# Altium project HW_RV_TOUCH_R1M1.PrjPcb (part 2 of 4)

## Sheet 06_BUTTONS.SchDoc: =TitleParameter
size A3; Address: Crete IL; Organization: ASISGUARD; Address1: Kemalpasa, Kemalpasa Cd. No:290 D:292H, 35060 Bornova/Izmir/Turkey; Revision: R1M1
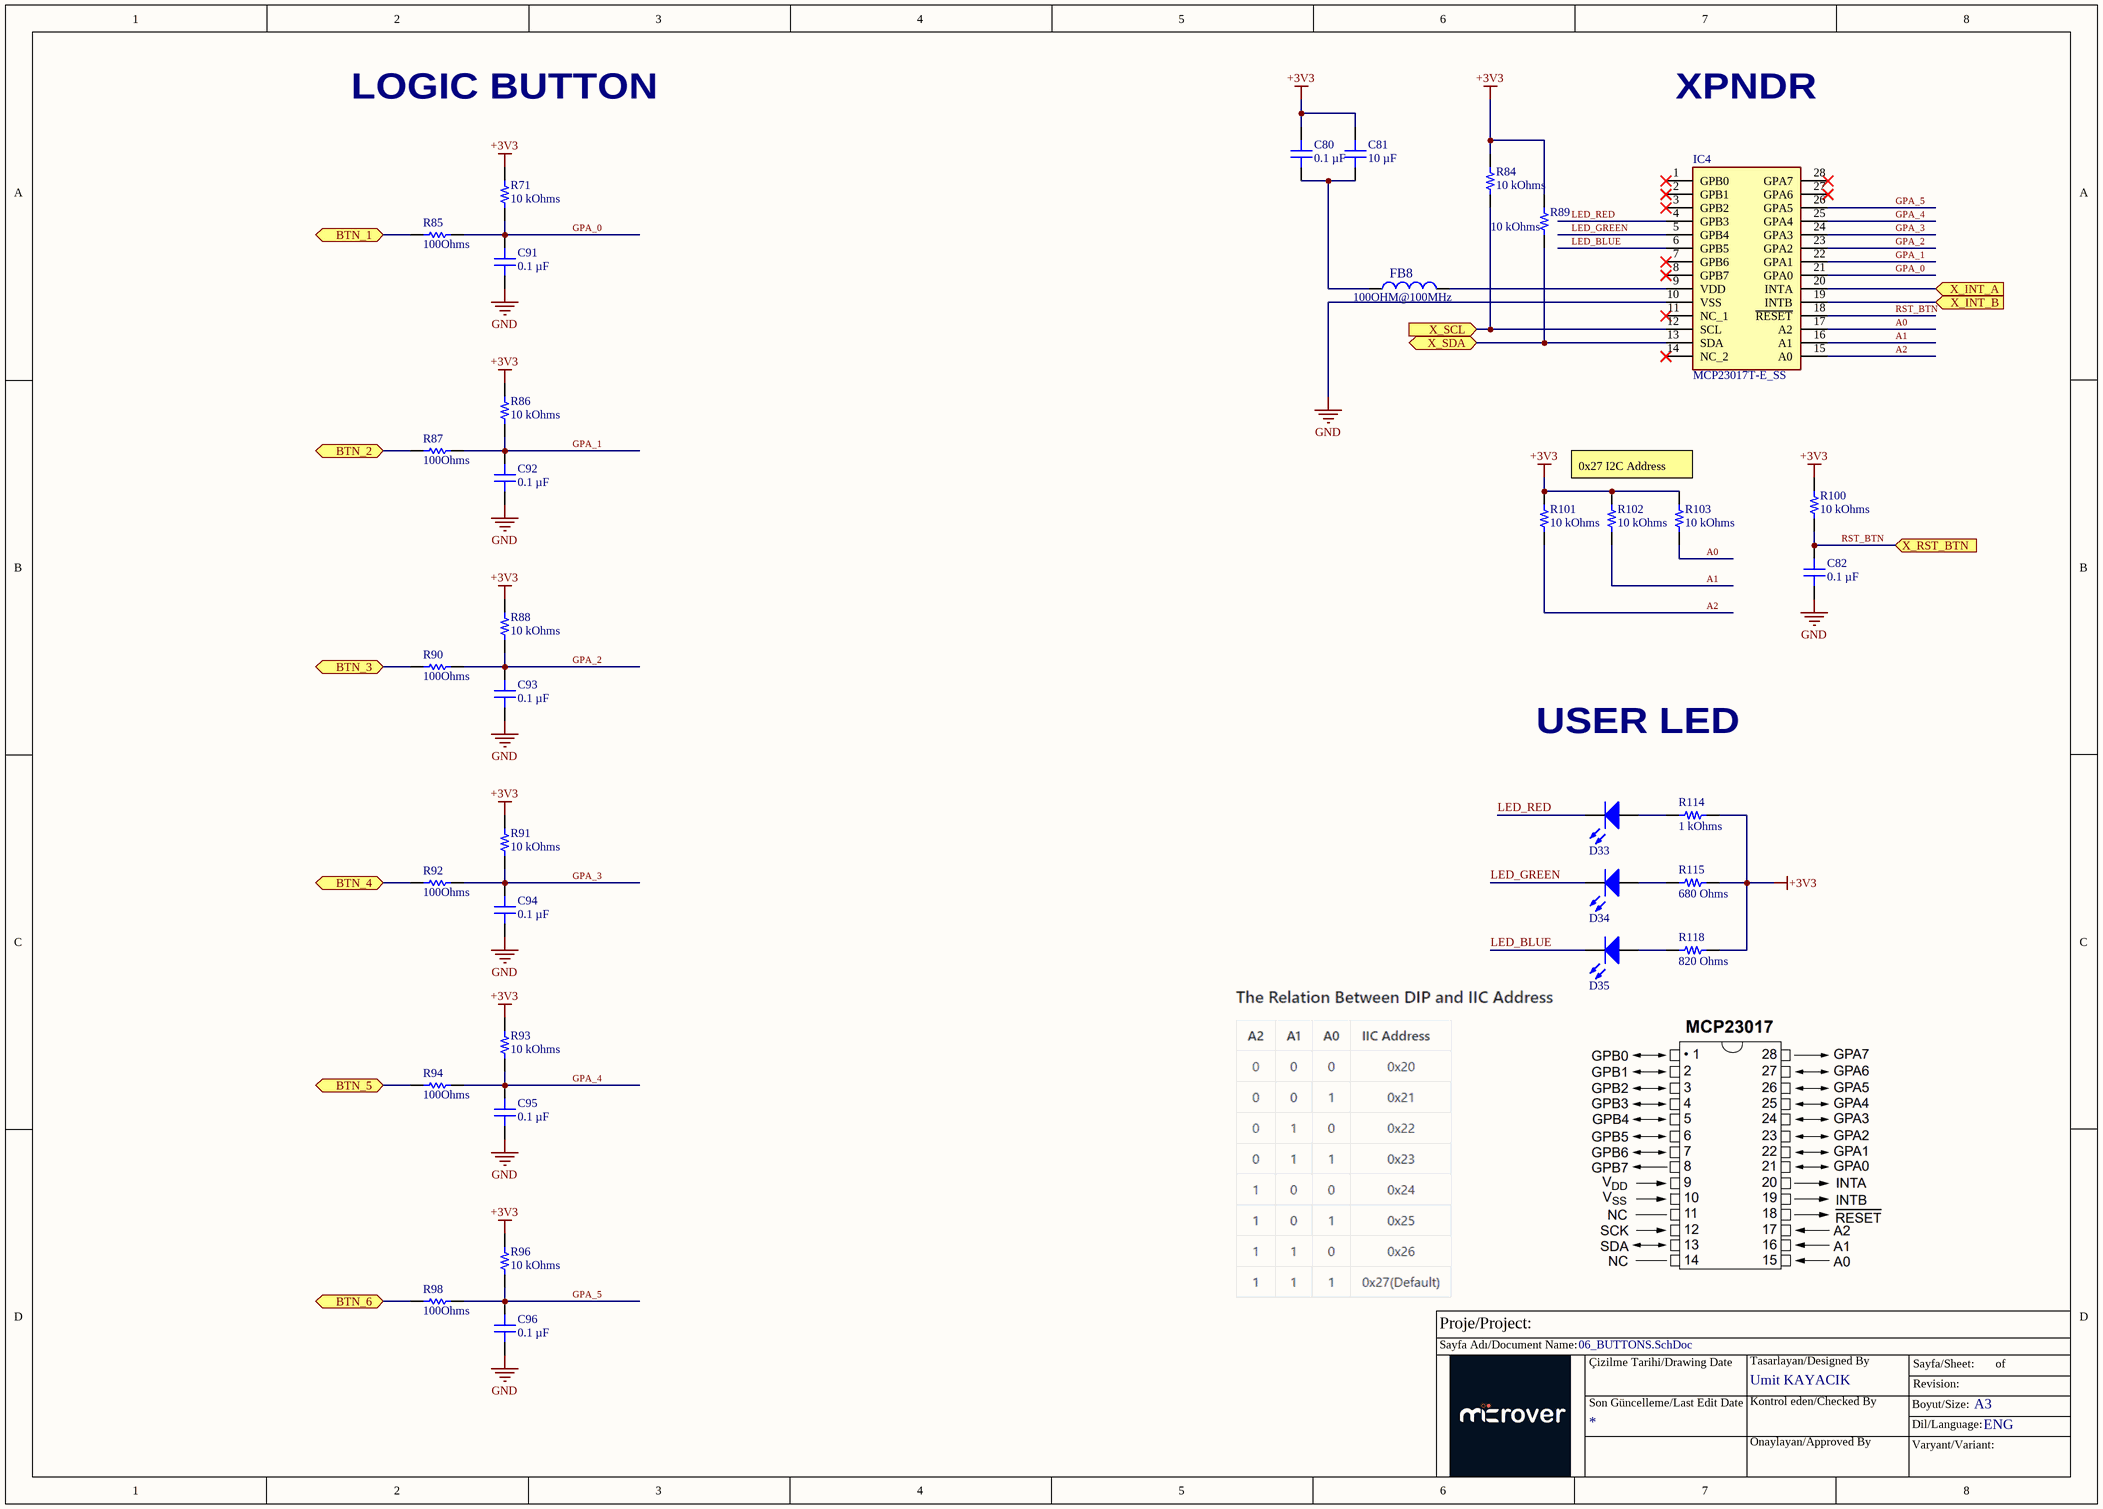
[diagram p5: 06_BUTTONS.SchDoc]

### Parts
C80  0.1 µF  [CAP 0603_1608]
C81  10 µF  [CAP 0603_1608]
C82  0.1 µF  [CAP 0603_1608]
C91  0.1 µF  [CAP0603]
C92  0.1 µF  [CAP0603]
C93  0.1 µF  [CAP0603]
C94  0.1 µF  [CAP0603]
C95  0.1 µF  [CAP0603]
C96  0.1 µF  [CAP0603]
D33  LED RED  [LED0805]  (value not drawn)
D34  LED GREEN  [LED0805]  (value not drawn)
D35  LED BLUE  [LED0805]  (value not drawn)
FB8  100OHM@100MHz  [FB 0603(1608)]
IC4  MCP23017T-E_SS  [SOP65P780X200-28N]
R71  10 kOhms  [RES0402(1005)]
R84  10 kOhms  [RES 0402_1005]
R85  100Ohms  [RESC1005X40X25ML05T10]
R86  10 kOhms  [RES0402(1005)]
R87  100Ohms  [RESC1005X40X25ML05T10]
R88  10 kOhms  [RES0402(1005)]
R89  10 kOhms  [RES 0402_1005]
R90  100Ohms  [RESC1005X40X25ML05T10]
R91  10 kOhms  [RES0402(1005)]
R92  100Ohms  [RESC1005X40X25ML05T10]
R93  10 kOhms  [RES0402(1005)]
R94  100Ohms  [RESC1005X40X25ML05T10]
R96  10 kOhms  [RES0402(1005)]
R98  100Ohms  [RESC1005X40X25ML05T10]
R100  10 kOhms  [RES 0402_1005]
R101  10 kOhms  [RES 0402_1005]
R102  10 kOhms  [RES 0402_1005]
R103  10 kOhms  [RES 0402_1005]
R114  1 kOhms  [RES 0402_1005]
R115  680 Ohms  [RES 0402_1005]
R118  820 Ohms  [RES 0402_1005]

### Ports
BTN_1 (bidir), BTN_2 (bidir), BTN_3 (bidir), BTN_4 (bidir), BTN_5 (bidir), BTN_6 (bidir), X_INT_A (in), X_INT_B (in), X_RST_BTN (in), X_SCL (in), X_SDA (bidir)

### Nets
+3V3: C80.2 C81.2 R71.2 R84.2 R86.2 R88.2 R89.2 R91.2 R93.2 R96.2 R100.2 R101.2 R102.2 R103.2 R114.2 R115.2 R118.2
GND: C82.1 C91.1 C92.1 C93.1 C94.1 C95.1 C96.1 IC4.10(VSS)
A0: IC4.17(A2) R103.1
A1: IC4.16(A1) R102.1
A2: IC4.15(A0) R101.1
GPA_0: C91.2 IC4.21(GPA0) R71.1 R85.2
GPA_1: C92.2 IC4.22(GPA1) R86.1 R87.2
GPA_2: C93.2 IC4.23(GPA2) R88.1 R90.2
GPA_3: C94.2 IC4.24(GPA3) R91.1 R92.2
GPA_4: C95.2 IC4.25(GPA4) R93.1 R94.2
GPA_5: C96.2 IC4.26(GPA5) R96.1 R98.2
LED_BLUE: D35.1(K) IC4.6(GPB5)
LED_GREEN: D34.1(K) IC4.5(GPB4)
LED_RED: D33.1(K) IC4.4(GPB3)
RST_BTN: C82.2 IC4.18(~{RESET}) R100.1 ; port X_RST_BTN
NetC80_1: C80.1 C81.1 FB8.2
NetD33_2: D33.2(A) R114.1
NetD34_2: D34.2(A) R115.1
NetD35_2: D35.2(A) R118.1
NetFB8_1: FB8.1 IC4.9(VDD)
NetIC4_12: IC4.12(SCL) R84.1 ; port X_SCL
NetIC4_13: IC4.13(SDA) R89.1 ; port X_SDA
NetIC4_19: IC4.19(INTB) ; port X_INT_B
NetIC4_20: IC4.20(INTA) ; port X_INT_A
NetJ12_1: R98.1 ; port BTN_6
NetJ12_2: R94.1 ; port BTN_5
NetJ12_3: R92.1 ; port BTN_4
NetJ12_4: R90.1 ; port BTN_3
NetJ12_5: R87.1 ; port BTN_2
NetJ12_6: R85.1 ; port BTN_1

Not connected (* = marked no-connect by the designer): IC4 1(GPB0)* 2(GPB1)* 3(GPB2)* 7(GPB6)* 8(GPB7)* 11(NC_1)* 14(NC_2)* 27(GPA6)* 28(GPA7)*

### Notes on the sheet
- LOGIC BUTTON
- XPNDR
- 0x27 I2C Address
- USER LED
- Proje/Project:
- Sayfa Adı/Document Name:
- Çizilme Tarihi/Drawing Date
- Umit KAYACIK
- Tasarlayan/Designed By
- Sayfa/Sheet:
- Revision:
- of
- Son Güncelleme/Last Edit Date
- Kontrol eden/Checked By
- Onaylayan/Approved By
- Boyut/Size:
- Varyant/Variant:
- Dil/Language:
- A3
- ENG

### Library data of the parts
C80 C82 C91-C96 = VJ0603Y104KXAPW1BC: CAP CER 0.1UF 50V X7R 0603; manufacturer: Vishay Vitramon; Tolerance: ±10%; Part Number: VJ0603Y104KXAPW1BC; Value: 0.1 µF; Applications: General Purpose; Capacitance: 0.1 µF; componentlink2description: DigiKey Link; componentlink2url: https://www.digikey.com/en/products/detail/vishay-vitramon/VJ0603Y104KXAPW1BC/10670836; Device Package: 0603 (1608 Metric); lastupdated: 2/9/2024 8:09:50 PM; Lifecycle Status: Active; Minimum Order: 1; Mounting Type: Surface Mount, MLCC; Operating Temperature: -55°C ~ 125°C; Package / Case: 0603 (1608 Metric); packaging: TapeAndReel; partid: 45127; Part Status: Active; price: 0.02; series: VJ W1BC; Size / Dimension: 0.063" L x 0.031" W (1.60mm x 0.80mm); Supplier 1: DigiKey; Supplier Part Number 1: 720-VJ0603Y104KXAPW1BCCT-ND; Temperature Coefficient: X7R; Thickness (Max): 0.037" (0.95mm); Voltage - Rated: 50V
C81 = KGM15CR51C106KT: CAP CER 10UF 16V X5R 0603; manufacturer: KYOCERA AVX; Tolerance: ±10%; Part Number: KGM15CR51C106KT; Value: 10 µF; Applications: General Purpose; Capacitance: 10 µF; componentlink1description: Datasheet; componentlink1url: https://datasheets.kyocera-avx.com/cx5r.pdf; componentlink2description: DigiKey Link; componentlink2url: https://www.digikey.com/en/products/detail/kyocera-avx/KGM15CR51C106KT/17866320; Device Package: 0603 (1608 Metric); lastupdated: 2/9/2024 8:08:56 PM; Lifecycle Status: Active; Minimum Order: 1; Mounting Type: Surface Mount, MLCC; Operating Temperature: -55°C ~ 85°C; Package / Case: 0603 (1608 Metric); packaging: TapeAndReel; partid: 54717; Part Status: Active; price: 0.03; series: KGM - X5R; Size / Dimension: 0.063" L x 0.031" W (1.60mm x 0.80mm); Supplier 1: DigiKey; Supplier Part Number 1: 478-KGM15CR51C106KTCT-ND; Temperature Coefficient: X5R; Thickness (Max): 0.039" (1.00mm); Voltage - Rated: 16V
D33 = LED0805_RED: SMD mono-color Chip LED, WL-SMCW, Red; Manufacturer Part Number: 150080RS75000; Manufacturer: Wuerth Elektronik; ComponentLink1Description: Manufacturer URL; ComponentLink2Description: Datasheet; Color: Red; ComponentLink1URL: http://www.we-online.com; PackageReference: 0805_A; ComponentLink2URL: http://katalog.we-online.com/led/datasheet/150080RS75000.pdf
D34 = LED0805_GREEN: Green 570nm LED Indication - Discrete 2.1V 0805 (2012 Metric); Manufacturer Part Number: CMD17-21VGC/TR8; Manufacturer: Visual Communications Company - VCC; Color: Red; ComponentLink1Description: Manufacturer URL; ComponentLink2Description: Datasheet; ComponentLink1URL: http://www.we-online.com; PackageReference: 0805_A; ComponentLink2URL: http://katalog.we-online.com/led/datasheet/150080RS75000.pdf
D35 = LED0805_BLUE: Blue 470nm LED Indication - Discrete 3V 0805 (2012 Metric); Manufacturer Part Number: IN-S85AT5B; Manufacturer: Inolux; Color: Red; ComponentLink1Description: Manufacturer URL; ComponentLink2Description: Datasheet; ComponentLink1URL: http://www.we-online.com; PackageReference: 0805_A; ComponentLink2URL: http://katalog.we-online.com/led/datasheet/150080RS75000.pdf
FB8 = FB0603_100OHM_100MHz: 100 Ohms @ 100 MHz 1 Power Line Ferrite Bead 0603 (1608 Metric) 2A 40mOhm; Manufacturer: TDK; Manufacturer Part Number: MPZ1608Y101BTA00; Tolerance: 25%; Impedance: 100R; DC Resistance (DCR): 40mR; ComponentLink1URL: https://chn-vm-apps.microchip.com/mchprepo/parts/Datasheets/beads_commercial_power_mpz_en.pdf; ComponentLink1Description: Datasheet; Supplier 1: Digi-Key; Supplier Part Number 1: 445-2984-1-ND; RoHS: Yes; Category: Ferrite Beads and Chips; Stock 1: 551; Pricing 1: 1=0,10000, 10=0,07200, 25=0,06480, 50=0,05840, 100=0,04290, 250=0,03120, 500=0,02860, 1000=0,02470 (USD); Mount: Surface Mount; Case/Package: 0603; Case Code (Metric): 1608; Case Code (Imperial): 0603; Core Material: Ferrite; Packaging: Tape and Reel; Package Quantity: 4000; Max DC Current: 2A; Current Rating: 2A; Series: MPZ; Length: 0.063inch; Width: 0.031inch; Height: 0.037inch; RoHS Compliant: Yes; REACH SVHC: No SVHC; ComponentLink2URL: https://datasheet.ciiva.com/46634/beads-commercial-power-mpz-en-46634677.pdf?src-supplier=Digi-Key; ComponentLink2Description: https://datasheet.ciiva.com/46634/beads-commercial-power-mpz-en-46634677.pdf?src-supplier=Digi-Key; ComponentLink3URL: https://datasheet.ciiva.com/48682/beads-commercial-power-mpz-en-48682501.pdf?src-supplier=Avnet; ComponentLink3Description: https://datasheet.ciiva.com/48682/beads-commercial-power-mpz-en-48682501.pdf?src-supplier=Avnet; ComponentLink4URL: https://datasheet.ciiva.com/46634/beads-commercial-power-mpz-en-46634684.pdf?src-supplier=Digi-Key; ComponentLink4Description: https://datasheet.ciiva.com/46634/beads-commercial-power-mpz-en-46634684.pdf?src-supplier=Digi-Key; ComponentLink5URL: https://datasheet.ciiva.com/46634/beads-commercial-power-mpz-en-46634621.pdf?src-supplier=Digi-Key; ComponentLink5Description: https://datasheet.ciiva.com/46634/beads-commercial-power-mpz-en-46634621.pdf?src-supplier=Digi-Key; Parameter 1: *; LCSC Manufacturer Part Number: MPZ1608Y101BTA00; LCSC Part Number: C501996
IC4 = MCP23017T-E_SS: Integrated Circuit; Manufacturer_Name: Microchip; Manufacturer_Part_Number: MCP23017T-E/SS; Datasheet Link: https://datasheet.datasheetarchive.com/originals/distributors/SFDatasheet-4/sf-00090057.pdf; Height: 2mm; Mouser Part Number: 579-MCP23017T-E/SS; Mouser Price/Stock: https://www.mouser.co.uk/ProductDetail/Microchip-Technology/MCP23017T-E-SS?qs=usxtMOJb1Rz2FhASIaFluQ%3D%3D; Arrow Part Number: MCP23017T-E/SS; Arrow Price/Stock: https://www.arrow.com/en/products/mcp23017t-ess/microchip-technology?region=nac
R71 R84 R86 R88 R89 R91 R93 R96 R100-R103 = RP73PF1E10KBTD: RES 10K OHM 0.1% 1/10W 0402; Manufacturer: TE Connectivity Passive Product; Power (Watts): 0.1W, 1/10W; Temperature Coefficient: ±25ppm/°C; Part Number: RP73PF1E10KBTD; Value: 10 kOhms; ComponentLink1Description: Datasheet; ComponentLink1URL: https://www.te.com/commerce/DocumentDelivery/DDEController?Action=srchrtrv&DocNm=1773272&DocType=DS&DocLang=English; ComponentLink2Description: DigiKey Link; ComponentLink2URL: https://www.digikey.com/en/products/detail/te-connectivity-passive-product/RP73PF1E10KBTD/8260957; Composition: Thin Film; Device Package: 0402 (1005 Metric); Height - Seated (Max): 0.014" (0.35mm); LastUpdated: 2/9/2024 8:30:24 PM; Lifecycle Status: Active; Minimum Order: 1; Number of Terminations: 2; Operating Temperature: -55°C ~ 155°C; Package / Case: 0402 (1005 Metric); Packaging: TapeAndReel; PartId: 2434; Part Status: Active; Price: 0.08; Resistance: 10 kOhms; Series: RP73, Holsworthy; Size / Dimension: 0.039" L x 0.020" W (1.00mm x 0.50mm); Supplier 1: DigiKey; Supplier Part Number 1: A127415CT-ND; Supplier Device Package: 0402; Tolerance: ±0.1%
R85 R87 R90 R92 R94 R98 = CMP-2002-07344-1: Part Number: RC0402FR-07100RL; Manufacturer: Yageo / Phycomp
R114 = ERJ-U02D1001X: 0402 ANTI-SULFUR RES. , 0.5%, 1K; Manufacturer: Panasonic Electronic Components; Power (Watts): 0.1W, 1/10W; Temperature Coefficient: ±200ppm/°C; Part Number: ERJ-U02D1001X; Value: 1 kOhms; ComponentLink1Description: Datasheet; ComponentLink1URL: https://industrial.panasonic.com/cdbs/www-data/pdf/RDP0000/AOA0000C334.pdf; ComponentLink2Description: DigiKey Link; ComponentLink2URL: https://www.digikey.com/en/products/detail/panasonic-electronic-components/ERJ-U02D1001X/9365326; Composition: Thick Film; Device Package: 0402 (1005 Metric); Features: Anti-Sulfur, Automotive AEC-Q200; Height - Seated (Max): 0.016" (0.40mm); LastUpdated: 2/9/2024 8:28:26 PM; Lifecycle Status: Active; Minimum Order: 1; Number of Terminations: 2; Operating Temperature: -55°C ~ 155°C; Package / Case: 0402 (1005 Metric); Packaging: TapeAndReel; PartId: 81776; Price: 0.01; Ratings: AEC-Q200; Resistance: 1 kOhms; Series: ERJ-U02; Size / Dimension: 0.039" L x 0.020" W (1.00mm x 0.50mm); Supplier 1: DigiKey; Supplier Part Number 1: 10-ERJ-U02D1001XCT-ND; Supplier Device Package: 0402; Tolerance: ±0.5%
R115 = ERJ-U02F6800X: RES 680 OHM 1% 1/10W 0402 SMD; Manufacturer: Panasonic Electronic Components; Power (Watts): 0.1W, 1/10W; Temperature Coefficient: ±200ppm/°C; Part Number: ERJ-U02F6800X; Value: 680 Ohms; ComponentLink1Description: Datasheet; ComponentLink1URL: https://industrial.panasonic.com/cdbs/www-data/pdf/RDP0000/AOA0000C334.pdf; ComponentLink2Description: DigiKey Link; ComponentLink2URL: https://www.digikey.com/en/products/detail/panasonic-electronic-components/ERJ-U02F6800X/11635400; Composition: Thick Film; Device Package: 0402 (1005 Metric); Features: Anti-Sulfur, Automotive AEC-Q200; Height - Seated (Max): 0.016" (0.40mm); LastUpdated: 2/9/2024 8:29:06 PM; Lifecycle Status: Active; Minimum Order: 1; Number of Terminations: 2; Operating Temperature: -55°C ~ 155°C; Package / Case: 0402 (1005 Metric); Packaging: TapeAndReel; PartId: 60041; Part Status: Active; Price: 0.01; Ratings: AEC-Q200; Resistance: 680 Ohms; Series: ERJ-U02; Size / Dimension: 0.039" L x 0.020" W (1.00mm x 0.50mm); Supplier 1: DigiKey; Supplier Part Number 1: 10-ERJ-U02F6800XCT-ND; Supplier Device Package: 0402; Tolerance: ±1%
R118 = ERJ-2RKF8200X: RES SMD 820 OHM 1% 1/10W 0402; Manufacturer: Panasonic Electronic Components; Power (Watts): 0.1W, 1/10W; Temperature Coefficient: ±100ppm/°C; Part Number: ERJ-2RKF8200X; Value: 820 Ohms; ComponentLink1Description: Datasheet; ComponentLink1URL: https://industrial.panasonic.com/cdbs/www-data/pdf/RDA0000/AOA0000C304.pdf; ComponentLink2Description: DigiKey Link; ComponentLink2URL: https://www.digikey.com/en/products/detail/panasonic-electronic-components/ERJ-2RKF8200X/1746279; Composition: Thick Film; Device Package: 0402 (1005 Metric); Features: Automotive AEC-Q200; Height - Seated (Max): 0.016" (0.40mm); LastUpdated: 2/9/2024 8:29:33 PM; Lifecycle Status: Active; Minimum Order: 1; Number of Terminations: 2; Operating Temperature: -55°C ~ 155°C; Package / Case: 0402 (1005 Metric); Packaging: CutTape; PartId: 18007; Part Status: Active; Price: 0.01; Ratings: AEC-Q200; Resistance: 820 Ohms; Series: ERJ-2RK; Size / Dimension: 0.039" L x 0.020" W (1.00mm x 0.50mm); Supplier 1: DigiKey; Supplier Part Number 1: P820LCT-ND; Supplier Device Package: 0402; Tolerance: ±1%

## Sheet 07_GSM_EM05.SchDoc: =TitleParameter
size A3; Address: Crete IL; Organization: ASISGUARD; Address1: Kemalpasa, Kemalpasa Cd. No:290 D:292H, 35060 Bornova/Izmir/Turkey; Revision: R1M1
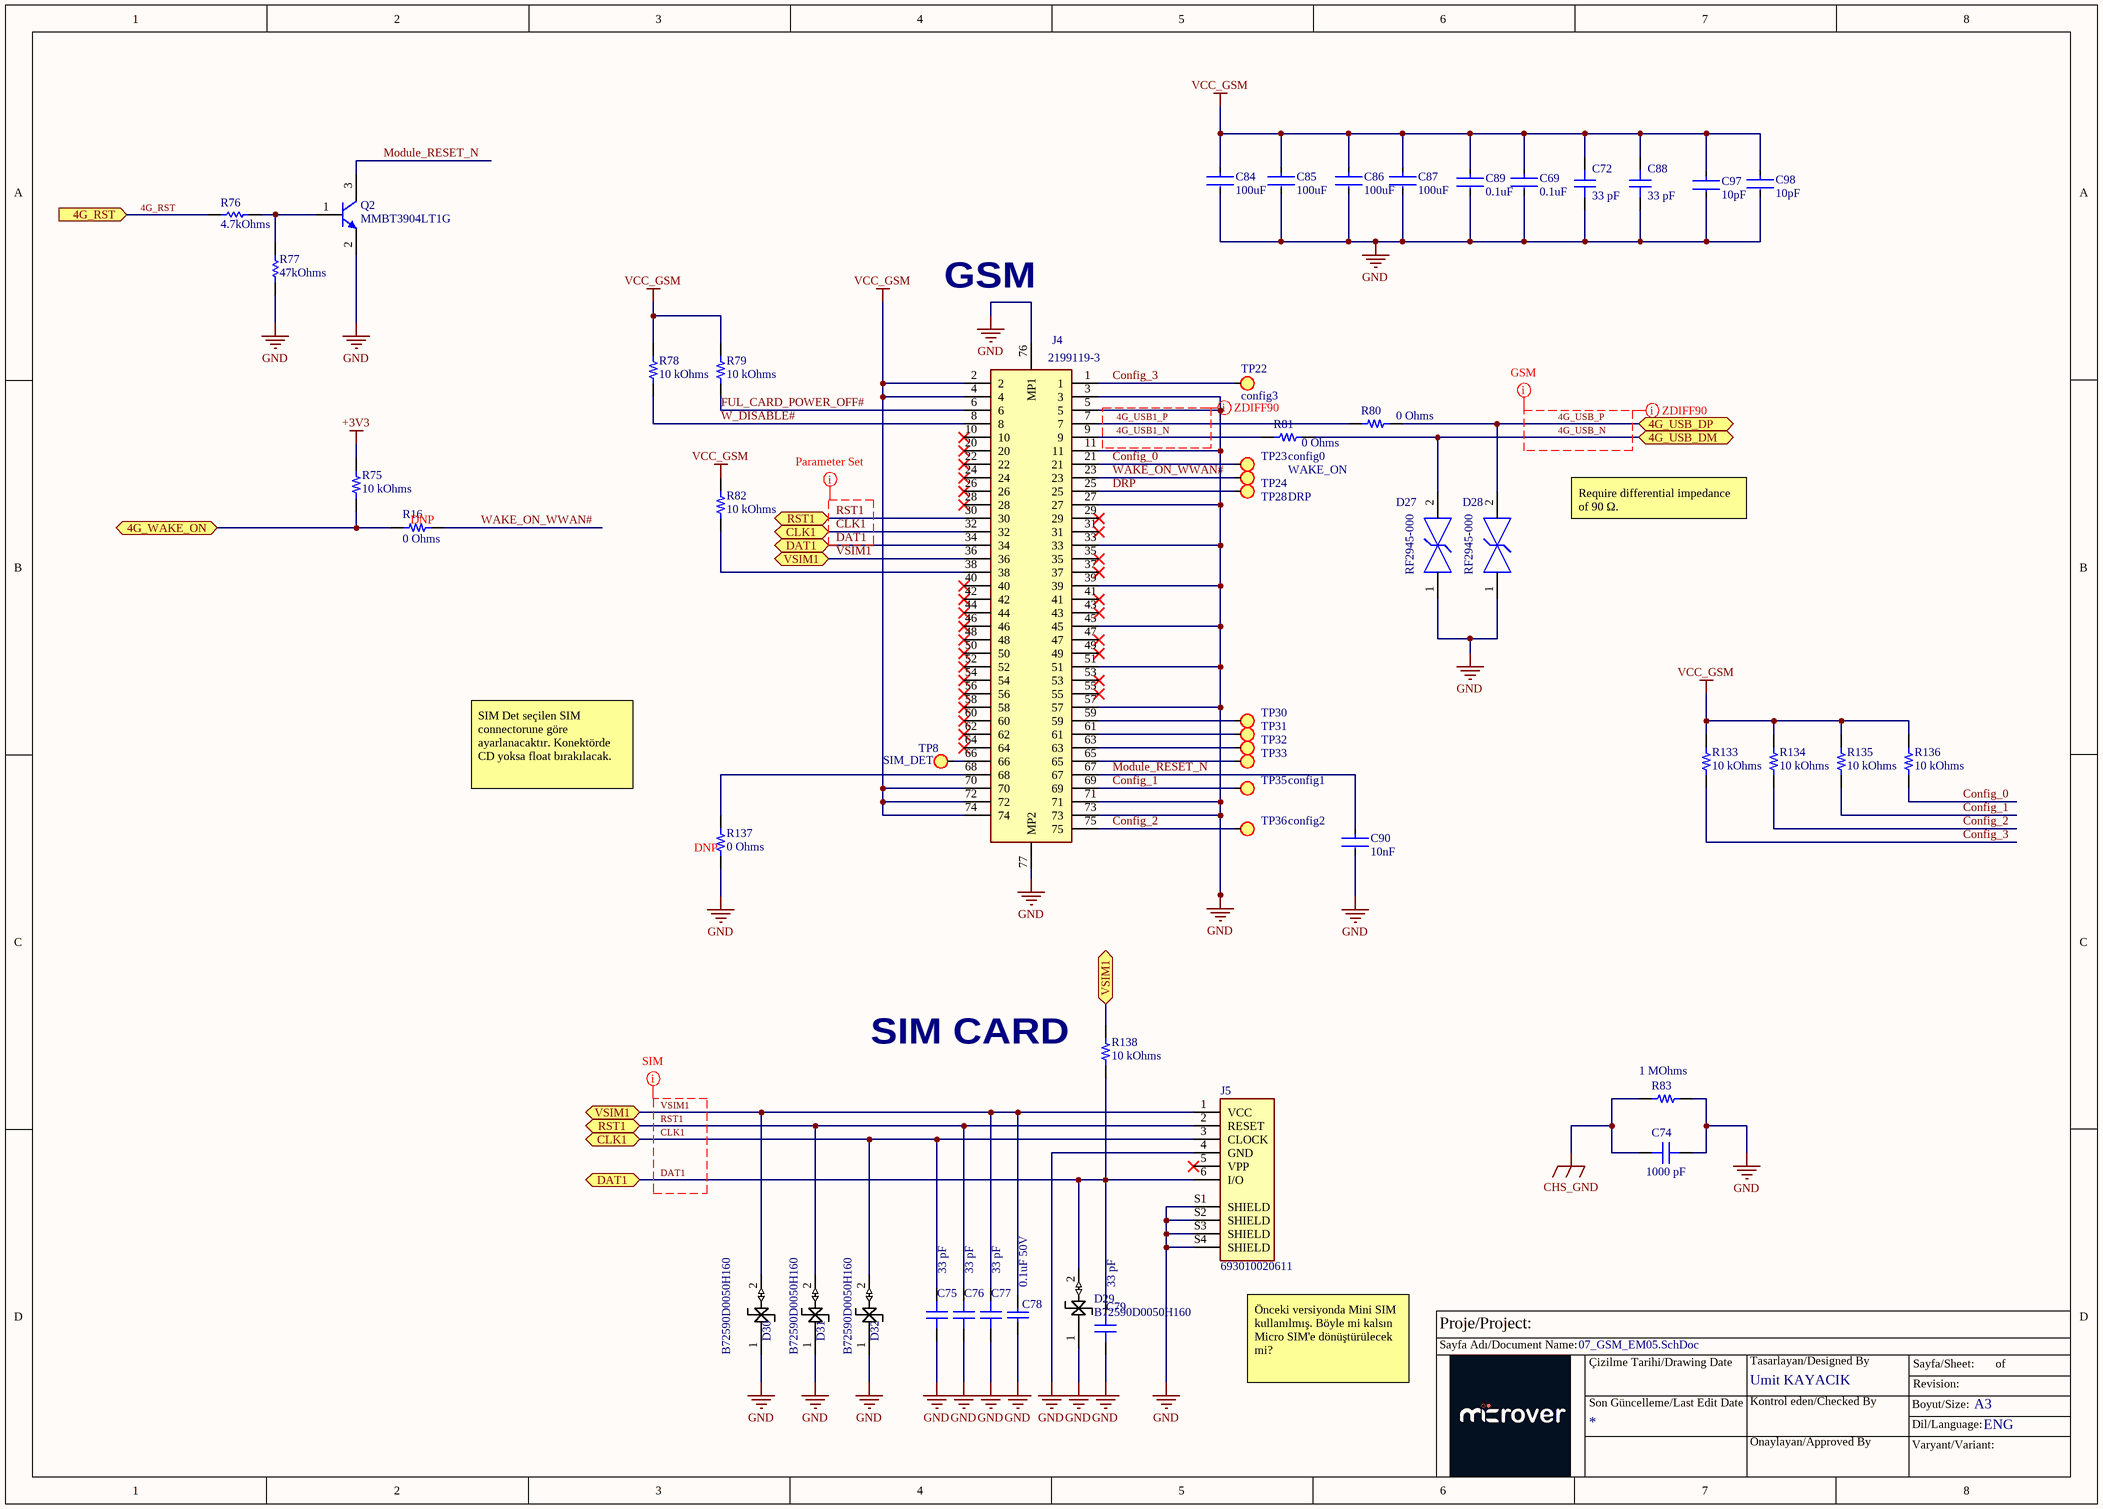
[diagram p6: 07_GSM_EM05.SchDoc]

### Parts
C69  0.1uF  [FP-GRM15-MFG]
C72  33 pF  [CAP0402(1005)X0.5]
C74  1000 pF  [CAP 1206_3216 - 0.8MM]
C75  33 pF  [CAP 0402_1005]
C76  33 pF  [CAP 0402_1005]
C77  33 pF  [CAP 0402_1005]
C78  value 0.1uF 50V  [SMC0603]  (hidden comment: CAP CER 0.1UF 50V X7R 0603)
C79  33 pF  [CAP 0402_1005]
C84  100uF  [FP-C3216-160-0_3-IPC_C]
C85  100uF  [FP-C3216-160-0_3-IPC_C]
C86  100uF  [FP-C3216-160-0_3-IPC_C]
C87  100uF  [FP-C3216-160-0_3-IPC_C]
C88  33 pF  [CAP0402(1005)X0.5]
C89  0.1uF  [FP-GRM15-MFG]
C90  10nF  [FP-CL165-IPC_C]
C97  10pF  [FP-CGA2B-MFG]
C98  10pF  [FP-CGA2B-MFG]
D27  RF2945-000  [FP-SESD0402-MFG]
D28  RF2945-000  [FP-SESD0402-MFG]
D29  B72590D0050H160  [SOD1005X60N]
D30  B72590D0050H160  [SOD1005X60N]
D31  B72590D0050H160  [SOD1005X60N]
D32  B72590D0050H160  [SOD1005X60N]
J4  2199119-3  [2199119-3]
J5  693010020611  [WURTH_693010020611]
Q2  MMBT3904LT1G  [ONSC-SOT-23-3-318-08_V]
R16  0 Ohms  [RES0402(1005)]
R75  10 kOhms  [RES 0402_1005]
R76  4.7kOhms  [RESC1005X40X25NL05T10]
R77  47kOhms  [RESC1005X40X25ML05T10]
R78  10 kOhms  [RES 0402_1005]
R79  10 kOhms  [RES 0402_1005]
R80  0 Ohms  [RES 0402_1005]
R81  0 Ohms  [RES 0402_1005]
R82  10 kOhms  [RES 0402_1005]
R83  1 MOhms  [RES 0402_1005]
R133  10 kOhms  [RES0402(1005)]
R134  10 kOhms  [RES0402(1005)]
R135  10 kOhms  [RES0402(1005)]
R136  10 kOhms  [RES0402(1005)]
R137  0 Ohms  [RES0402(1005)]
R138  10 kOhms  [RES0402(1005)]
TP8  SIM_DET  [TEST_POINT]
TP22  config3  [TEST_POINT]
TP23  config0  [TEST_POINT]
TP24  WAKE_ON  [TEST_POINT]
TP28  DRP  [TEST_POINT]
TP30  (no value)  [TEST_POINT]
TP31  config0  [TEST_POINT]  (value not drawn)
TP32  (no value)  [TEST_POINT]
TP33  (no value)  [TEST_POINT]
TP35  config1  [TEST_POINT]
TP36  config2  [TEST_POINT]

### Ports
4G_RST (in), 4G_USB_DM (bidir), 4G_USB_DP (bidir), 4G_WAKE_ON (bidir), CLK1 (bidir), DAT1 (bidir), RST1 (bidir), VSIM1 (bidir)

### Nets
+3V3: R75.2
CHS_GND: C74.1 R83.1
GND: C69.1 C72.1 C74.2 C75.1 C76.1 C77.1 C78.1 C79.1 C84.2 C85.2 C86.2 C87.2 C88.1 C89.1 C90.2 C97.2 C98.2 D27.1 D28.1 D29.1(GND) D30.1(GND) D31.1(GND) D32.1(GND) J4.3 J4.5 J4.11 J4.27 J4.33 J4.39 J4.45 J4.51 J4.57 J4.71 J4.73 J4.76(MP1) J4.77(MP2) J5.4(GND) J5.S1(SHIELD) J5.S2(SHIELD) J5.S3(SHIELD) J5.S4(SHIELD) Q2.2(E) R77.1 R83.2 R137.2
VCC_GSM: C69.2 C72.2 C84.1 C85.1 C86.1 C87.1 C88.2 C89.2 C97.1 C98.1 J4.2 J4.4 J4.70 J4.72 J4.74 R78.2 R79.2 R82.2 R133.2 R134.2 R135.2 R136.2
4G_RST: R76.1 ; port 4G_RST
4G_USB1_N: J4.9 R81.2
4G_USB1_P: J4.7 R80.2
4G_USB_N: D27.2 R81.1 ; port 4G_USB_DM
4G_USB_P: D28.2 R80.1 ; port 4G_USB_DP
CLK1: C75.2 D32.2(I/OLINE) J4.32 J5.3(CLOCK) ; port CLK1
Config_0: J4.21 R136.1 TP23.1(TP)
Config_1: J4.69 R135.1 TP35.1(TP)
Config_2: J4.75 R134.1 TP36.1(TP)
Config_3: J4.1 R133.1 TP22.1(TP)
DAT1: C79.2 D29.2(I/OLINE) J4.34 J5.6(I/O) R138.1 ; port DAT1
DRP: J4.25 TP28.1(TP)
FUL_CARD_POWER_OFF#: J4.6 R79.1
Module_RESET_N: C90.1 J4.67 Q2.3(C)
RST1: C76.2 D31.2(I/OLINE) J4.30 J5.2(RESET) ; port RST1
VSIM1: C77.2 C78.2 D30.2(I/OLINE) J4.36 J5.1(VCC) R138.2 ; port VSIM1
W_DISABLE#: J4.8 R78.1
WAKE_ON_WWAN#: J4.23 R16.2 TP24.1(TP)
NetJ4_38: J4.38 R82.1
NetJ4_59: J4.59 TP30.1(TP)
NetJ4_61: J4.61 TP31.1(TP)
NetJ4_63: J4.63 TP32.1(TP)
NetJ4_65: J4.65 TP33.1(TP)
NetJ4_66: J4.66 TP8.1(TP)
NetJ4_68: J4.68 R137.1
NetQ2_1: Q2.1(B) R76.2 R77.2
NetR16_1: R16.1 R75.1 ; port 4G_WAKE_ON

Not connected (* = marked no-connect by the designer): J4 10* 20* 22* 24* 26* 28* 29* 31* 35* 37* 40* 41* 42* 43* 44* 46* 47* 48* 49* 50* 52* 53* 54* 55* 56* 58* 60* 62* 64*; J5 5(VPP)*

### Layout directives
net class SIM: CLK1, DAT1, RST1, VSIM1
differential pair; differential pair class ZDIFF90: 4G_USB1_N, 4G_USB1_P, 4G_USB_N, 4G_USB_P
net class GSM: 4G_USB_N, 4G_USB_P
net class SIM; rule Matched Net Lengths [Tolerance = 20mil]: CLK1, DAT1, RST1

### Notes on the sheet
- GSM
- Require differential impedance of 90 Ω.
- (near R16) DNP
- SIM Det seçilen SIM connectorune göre ayarlanacaktır. Konektörde CD yoksa float bırakılacak.
- (near R137) DNP
- SIM CARD
- Önceki versiyonda Mini SIM kullanılmış. Böyle mi kalsın Micro SIM'e dönüştürülecek mi?
- Proje/Project:
- Sayfa Adı/Document Name:
- Çizilme Tarihi/Drawing Date
- Umit KAYACIK
- Tasarlayan/Designed By
- Sayfa/Sheet:
- Revision:
- of
- Son Güncelleme/Last Edit Date
- Kontrol eden/Checked By
- Onaylayan/Approved By
- Boyut/Size:
- Varyant/Variant:
- Dil/Language:
- A3
- ENG

### Library data of the parts
C69 C89 = CMP-2100-03641-2: CAP CER 0.1UF 16V X7R 0402; Part Number: GRM155R71C104KA88D; Manufacturer: Murata; Standoff Height: 0mm; Tolerance: 10%; Voltage Rating: 16Vdc; Material: Ceramic; Capacitance: 0.10μF; Value: 0.10μF; RoHS: TRUE; Temperature Characteristic: X7R; Octopart: https://octopart.com/grm155r71c104ka88d-murata-196880; Digikey Description: CAP CER 0.1UF 16V X7R 0402; Device Class L3: Ceramic Capacitors; Height: 0.55mm; ComponentLink2Description: Datasheet; Temperature Range Low: -55°C; Ipc Land Pattern Name: CAPC10050X219; ComponentLink2URL: https://search.murata.co.jp/Ceramy/image/img/A01X/G101/ENG/GRM155R71H471KA01-01A.pdf; Device Class L1: Passive Components; Lead Free: yes; Category: Cap; Package: GRM15; Temperature: -55°C to +125°C; Device Class L2: Capacitors; Temperature Range High: +125°C; Mouser Description: 0402 0.1 uF 16V ±10 % Tolerance X7R SMT Multilayer Ceramic Capacitor
C72 C75-C77 C79 C88 = 885012005043: CAP CER 33PF 25V C0G/NP0 0402; manufacturer: Würth Elektronik; Temperature Coefficient: C0G, NP0; Tolerance: ±5%; Part Number: 885012005043; Value: 33 pF; Applications: General Purpose; Capacitance: 33 pF; componentlink1description: Datasheet; componentlink1url: https://katalog.we-online.de/pbs/datasheet/885012005043.pdf; componentlink2description: DigiKey Link; componentlink2url: https://www.digikey.com/en/products/detail/würth-elektronik/885012005043/5453313; Device Package: 0402 (1005 Metric); lastupdated: 2/9/2024 8:04:37 PM; Lifecycle Status: Active; Minimum Order: 1; Mounting Type: Surface Mount, MLCC; Operating Temperature: -55°C ~ 125°C; Package / Case: 0402 (1005 Metric); packaging: TapeAndReel; partid: 2058; Part Status: Active; price: 0.01; series: WCAP-CSGP; Size / Dimension: 0.039" L x 0.020" W (1.00mm x 0.50mm); Supplier 1: DigiKey; Supplier Part Number 1: 732-7458-1-ND; Thickness (Max): 0.022" (0.55mm); Voltage - Rated: 25V
C74 = 202R18W102KV4E: CAP CER 1000PF 2KV X7R 1206; Part Number: 202R18W102KV4E; Value: 1000 pF
C78 = CAP0603_0.1UF_50V: 0.1 µF ±10% 50V Ceramic Capacitor X7R 0603 (1608 Metric); Manufacturer Part Number: CL10B104KB8NNNL; LCSC Manufacturer Part Number: CL10B104KB8NNNC; Order Code: DIGI:1276-CL10B104KB8NNNLTR-ND; Sirius Stock Code: A063-AGC10300001226; LCSC Part Number: C1591
C84-C87 = CMP-2000-05396-3: Multilayer Ceramic Capacitors 100uF ±20% 10V X5R SMD 1206; Part Number: C3216X5R1A107M160AC; Voltage Rating (DC): 10V; Length: 3.2mm; Mount: Surface Mount; Depth: 1.6mm; Width: 1.6mm; Package Quantity: 1; Min Operating Temperature: -55°C; Packaging: Tape and Reel; Max Operating Temperature: 85°C; Dielectric: X5R; Construction: Flat; Case Code (Imperial): 1206; Capacitance: 100uF; Thickness: 0.075inch; Radiation Hardening: No; RoHS Compliant: Yes; Series: C; Dielectric Material: Ceramic; Voltage: 10V; REACH SVHC: No SVHC; Case Code (Metric): 3216; Weight: 0.000571oz; Height: 1.6mm; Voltage Rating: 10V; Termination: SMD/SMT; Lead Free: Lead Free; Tolerance: 20%; Case/Package: 1206; Resistor Type: Ceramic
C90 = CMP-13271-000387-1: Cap Ceramic 10nF 50V X7R ±10% SMD 0402 +125°C Paper T/R; Part Number: CL05B103KB5NNNC; Depth: 0.5mm; Length: 1mm; Lead Free: Lead Free; Case Code (Metric): 1005; Width: 0.02inch; Min Operating Temperature: -55°C; Thickness: 0.022inch; Package Quantity: 1; Mount: Surface Mount; Height: 0.5mm; Voltage: 50V; Material: Ceramic; Tolerance: 10%; Case Code (Imperial): 0402; Radiation Hardening: No; Case/Package: 0402; Max Operating Temperature: 125°C; Voltage Rating (DC): 50V; Contact Plating: Tin; Packaging: Tape and Reel; Voltage Rating: 50V; Capacitance: 10nF; Dielectric: X7R
C97 C98 = CMP-08246-001268-1: Cap Ceramic 10pF 50V C0G 0.5pF Pad SMD 0402 +125°C Automotive T/R; Part Number: CGA2B2C0G1H100D050BA; Max Operating Temperature: 125°C; Termination: SMD/SMT; Composition: Ceramic; Case Code (Metric): 1005; Length: 1mm; Depth: 0.5mm; Height: 0.5mm; Voltage Rating (DC): 50V; Case Code (Imperial): 0402; Packaging: Tape and Reel; Weight: 2.3E-05oz; Thickness: 0.022inch; Case/Package: 0402; Package Quantity: 1; Min Operating Temperature: -55°C; REACH SVHC: No SVHC; Lead Free: Lead Free; Dielectric: C0G; Width: 0.5mm; Voltage Rating: 50V; Mount: Surface Mount; Capacitance: 10pF; Ratings: AEC-Q200
D27 D28 = CMP-08607-000062-1: TVS DIODE 7V 10V 0402; Manufacturer: Littelfuse; Value: 0.1pF; Breakdown Voltage: 9.8V; Number Of Channels: 1; Peak Pulse Current: 2A; Direction: Bidirectional; Automotive Grade: Grade 1; Standoff Height: 0mm; Octopart: https://octopart.com/rf2945-000-littelfuse-56516902; Device Class L3: unset; ComponentLink2Description: Datasheet; Lead Free: Yes; Temperature Range Low: -55°C; Clamping Voltage: 10V; Digikey Description: TVS DIODE 7V 10V 0402; Category: Diode; Temperature: -55°C to +125°C; Device Class L1: Circuit Protection; Capacitance: 0.1pF; RoHS: TRUE; Device Class L2: TVS Diodes; Package: SESD0402; Reverse Standoff Voltage: 7V; Automotive: Yes; Height: 0.43mm; Manufacturer Part Number: RF2945-000; Temperature Range High: +125°C; ComponentLink2URL: https://www.littelfuse.com/~/media/electronics/datasheets/tvs_diode_arrays/littelfuse_tvs_diode_array_sesd_ultra_low_capacitance_discrete_tvs_datasheet.pdf.pdf
D29-D32 = B72590D0050H160: VARISTOR 150V 0402; Manufacturer: TDK EPCOS; Supplier 1: Digikey; Manufacturer Part Number: B72590D0050H160; RoHS: Yes; Category: Varistors; Stock 1: 130000; Pricing 1: 10000=0,04977, 30000=0,04666, 50000=0,04137, 100000=0,04044, 250000=0,03982 (USD); ComponentLink1URL: https://datasheet.octopart.com/B72590D0050H160-EPCOS-datasheet-10468447.pdf?src-supplier=Newark; ComponentLink1Description: https://datasheet.octopart.com/B72590D0050H160-EPCOS-datasheet-10468447.pdf?src-supplier=Newark; ComponentLink2URL: https://en.tdk.eu/inf/75/ds/High_speed_series.pdf?src-supplier=Verical; ComponentLink2Description: https://en.tdk.eu/inf/75/ds/High_speed_series.pdf?src-supplier=Verical; ComponentLink3URL: http://www.farnell.com/datasheets/1706828.pdf?src-supplier=Newark; ComponentLink3Description: http://www.farnell.com/datasheets/1706828.pdf?src-supplier=Newark; ComponentLink4URL: https://en.tdk.eu/inf/75/ds/High_speed_series.pdf?src-supplier=Digikey; ComponentLink4Description: https://en.tdk.eu/inf/75/ds/High_speed_series.pdf?src-supplier=Digikey; ComponentLink5URL: https://www.tdk-electronics.tdk.com/inf/75/ds/High_speed_series.pdf?src-supplier=Digikey; ComponentLink5Description: https://www.tdk-electronics.tdk.com/inf/75/ds/High_speed_series.pdf?src-supplier=Digikey; ComponentLink6URL: https://en.tdk.eu/inf/75/ds/High_speed_series.pdf?src-supplier=Arrow+Electronics; ComponentLink6Description: https://en.tdk.eu/inf/75/ds/High_speed_series.pdf?src-supplier=Arrow+Electronics; ComponentLink7URL: https://en.tdk.eu/inf/75/ds/High_speed_series.pdf?src-supplier=Quest; ComponentLink7Description: https://en.tdk.eu/inf/75/ds/High_speed_series.pdf?src-supplier=Quest; ComponentLink8URL: https://datasheet.octopart.com/B72590D0050H160-EPCOS-datasheet-157245974.pdf?src-supplier=LKR; ComponentLink8Description: https://datasheet.octopart.com/B72590D0050H160-EPCOS-datasheet-157245974.pdf?src-supplier=LKR; ComponentLink9URL: https://en.tdk.eu/inf/75/ds/High_speed_series.pdf?src-supplier=TTI; ComponentLink9Description: https://en.tdk.eu/inf/75/ds/High_speed_series.pdf?src-supplier=TTI; Supplier Part Number 1: 495-3684-2-ND
J4 = 2199119-3: Conn Power Card Edge Socket 67 POS 0.5mm Solder RA SMD T/R; Manufacturer: TE Connectivity; Plating: 157ConductorMaterial; Number of Positions: 67; PCB Mounting Orientation: Right Angle; Contact Current Rating: 500mA; Gender: Female; Voltage Rating: 50V; Insulation Resistance: 500MR; Circuit Application: 313ConnectorType; Row Spacing: 7.55mm; Supplier: Avnet; Part Number: 2199119-3; Manufacturer Part Number: 2199119-3; RoHS: Yes; Category: Card Edge Connectors; Stock: 40583; Pricing: 1200=0.83929, 2400=0.83264, 4800=0.8263, 7200=0.81996, 9600=0.81362 (USD); Mounting Technology: Surface Mount; Contact Material: Copper Alloy; Contact Plating: Gold,Matte; Housing Color: Black; Housing Material: Thermoplastic; Color: Black; Insulation Material: Thermoplastic; Min Operating Temperature: -40°C; Max Operating Temperature: 80°C; Packaging: Tape and Reel; Number of Rows: 2; Package Quantity: 1200; Current Rating: 500mA; Termination: Solder; Number of Contacts: 67; Series: -; Contact Type: -; Operating Supply Voltage: 50V; Length: 0.862inch; Width: 8.7mm; Height: 3.2mm; Pitch: 0.5mm; Radiation Hardening: No; RoHS Compliant: Yes; Reach SVHC Compliant: Unknown; ELV: 5681ELVCompliant; ComponentLink1URL: https://datasheet.ciiva.com/18495/eng-cd-2199119-c-c-2199119-c-18495968.pdf?src-supplier=Digikey; ComponentLink1Description: https://datasheet.ciiva.com/18495/eng-cd-2199119-c-c-2199119-c-18495968.pdf?src-supplier=Digikey; ComponentLink2URL: https://datasheet.ciiva.com/32373/eng-ds-1-1773702-1ngffqrg-en-0513-1-1773702-1-ngff-qrg-en-32373486.pdf?src-supplier=Onlinecomponents.com; ComponentLink2Description: https://datasheet.ciiva.com/32373/eng-ds-1-1773702-1ngffqrg-en-0513-1-1773702-1-ngff-qrg-en-32373486.pdf?src-supplier=Onlinecomponents.com; ComponentLink3URL: https://datasheet.ciiva.com/18495/eng-cd-2199119-c-c-2199119-c-18495966.pdf?src-supplier=Digikey; ComponentLink3Description: https://datasheet.ciiva.com/18495/eng-cd-2199119-c-c-2199119-c-18495966.pdf?src-supplier=Digikey; ComponentLink4URL: https://datasheet.ciiva.com/18495/eng-cd-2199119-c-c-2199119-c-18495967.pdf?src-supplier=Digikey; ComponentLink4Description: https://datasheet.ciiva.com/18495/eng-cd-2199119-c-c-2199119-c-18495967.pdf?src-supplier=Digikey; ComponentLink5URL: https://datasheet.ciiva.com/45228/eng-cd-2199119-b1-45228583.pdf?src-supplier=Avnet; ComponentLink5Description: https://datasheet.ciiva.com/45228/eng-cd-2199119-b1-45228583.pdf?src-supplier=Avnet; ComponentLink6URL: https://datasheet.ciiva.com/24089/eng-ds-1-1773702-1ngffqrg-en-0513-1-1773702-1-ngff-252877-24089929.pdf?src-supplier=Mouser; ComponentLink6Description: https://datasheet.ciiva.com/24089/eng-ds-1-1773702-1ngffqrg-en-0513-1-1773702-1-ngff-252877-24089929.pdf?src-supplier=Mouser
J5 = 693010020611: WR-CRD Mini SIM Card Connector Header Shielded; Manufacturer: Wurth Electronics; Supplier 1: Digikey; Manufacturer Part Number: 693010020611; RoHS: Yes; Category: Memory Connectors; Stock 1: 1000; Pricing 1: 1000=1.04 (USD); ComponentLink1URL: https://datasheet.ciiva.com/25605/0900766b81113f2a-25605361.pdf?src-supplier=Rs; ComponentLink1Description: https://datasheet.ciiva.com/25605/0900766b81113f2a-25605361.pdf?src-supplier=Rs; ComponentLink2URL: https://datasheet.ciiva.com/1104/693010020611-1104791.pdf?src-supplier=Element14; ComponentLink2Description: https://datasheet.ciiva.com/1104/693010020611-1104791.pdf?src-supplier=Element14; ComponentLink3URL: https://datasheet.ciiva.com/6934/693010020611-6934683.pdf?src-supplier=Digikey; ComponentLink3Description: https://datasheet.ciiva.com/6934/693010020611-6934683.pdf?src-supplier=Digikey; ComponentLink4URL: https://datasheet.ciiva.com/6934/693010020611-6934685.pdf?src-supplier=Digikey; ComponentLink4Description: https://datasheet.ciiva.com/6934/693010020611-6934685.pdf?src-supplier=Digikey; ComponentLink5URL: https://datasheet.ciiva.com/6934/693010020611-6934687.pdf?src-supplier=Digikey; ComponentLink5Description: https://datasheet.ciiva.com/6934/693010020611-6934687.pdf?src-supplier=Digikey; ComponentLink6URL: https://datasheet.ciiva.com/48686/001088834-da-01-en-wr-crd-sim-kartensockel-693010020611-48686971.pdf?src-supplier=Conrad; ComponentLink6Description: https://datasheet.ciiva.com/48686/001088834-da-01-en-wr-crd-sim-kartensockel-693010020611-48686971.pdf?src-supplier=Conrad; Supplier Part Number 1: 732-3814-2-ND
Q2 = CMP-1048-00631-1: General Purpose Transistor, NPN Silicon, 3-Pin SOT-23, Pb-Free, Tape and Reel; Manufacturer: On Semiconductor; IC Continuous (A): 0.2; fT Min (MHz): 300; ComponentLink2Description: Datasheet; Polarity: NPN; PackageDescription: 3-Pin Small Outline Transistor, Body 2.92 x 1.3 mm, Pitch 0.95 mm; ComponentLink2URL: http://www.onsemi.cn/pub_link/Collateral/MMBT3904LT1-D.PDF; DatasheetVersion: Rev. 12; Mounting Technology: Surface Mount; PartNumber: MMBT3904LT1G; ComponentLink1URL: http://www.onsemi.com/; ComponentLink3Description: Package Specification; ComponentLink1Description: Manufacturer URL; PackageVersion: Rev. AP, 11/2009; PackageReference: SOT-23-3-318-08; Packing: Tape and Reel; ComponentLink3URL: http://www.onsemi.cn/pub_link/Collateral/318-08.PDF; RoHS: TRUE
R16 R80 R81 R137 = HCJ0402ZT0R00: RES 0 OHM JUMPER 1/8W 0402; Manufacturer: Stackpole Electronics Inc; Power (Watts): 0.125W, 1/8W; Part Number: HCJ0402ZT0R00; Value: 0 Ohms; ComponentLink1Description: Datasheet; ComponentLink1URL: https://www.seielect.com/catalog/sei-hcj.pdf; ComponentLink2Description: DigiKey Link; ComponentLink2URL: https://www.digikey.com/en/products/detail/stackpole-electronics-inc/HCJ0402ZT0R00/4357659; Composition: Metal Foil; Device Package: 0402 (1005 Metric); Features: Automotive AEC-Q200; Height - Seated (Max): 0.018" (0.45mm); LastUpdated: 2/9/2024 8:29:49 PM; Lifecycle Status: Active; Minimum Order: 1; Number of Terminations: 2; Operating Temperature: -55°C ~ 155°C; Package / Case: 0402 (1005 Metric); Packaging: TapeAndReel; PartId: 12327; Part Status: Active; Price: 0.07; Ratings: AEC-Q200; Resistance: 0 Ohms; Series: HCJ; Size / Dimension: 0.039" L x 0.020" W (1.00mm x 0.50mm); Supplier 1: DigiKey; Supplier Part Number 1: HCJ0402ZT0R00CT-ND; Supplier Device Package: 0402; Tolerance: Jumper
R75 R78 R79 R82 R133-R136 R138 = RP73PF1E10KBTD: as R71 on sheet 06_BUTTONS; Part Number: RP73PF1E10KBTD; Value: 10 kOhms; ComponentLink1Description: Datasheet; ComponentLink1URL: https://www.te.com/commerce/DocumentDelivery/DDEController?Action=srchrtrv&DocNm=1773272&DocType=DS&DocLang=English; ComponentLink2Description: DigiKey Link; ComponentLink2URL: https://www.digikey.com/en/products/detail/te-connectivity-passive-product/RP73PF1E10KBTD/8260957; Composition: Thin Film; Device Package: 0402 (1005 Metric); Height - Seated (Max): 0.014" (0.35mm); LastUpdated: 2/9/2024 8:30:24 PM; Lifecycle Status: Active; Minimum Order: 1; Number of Terminations: 2; Operating Temperature: -55°C ~ 155°C; Package / Case: 0402 (1005 Metric); Packaging: TapeAndReel; PartId: 2434; Part Status: Active; Price: 0.08; Resistance: 10 kOhms; Series: RP73, Holsworthy; Size / Dimension: 0.039" L x 0.020" W (1.00mm x 0.50mm); Supplier 1: DigiKey; Supplier Part Number 1: A127415CT-ND; Supplier Device Package: 0402; Tolerance: ±0.1%
R76 = CMP-1011-00586-2: Manufacturer: Yageo / Phycomp; Part Number: RC0402FR-074K7L
R77 = CMP-2002-03053-1: Part Number: CRCW040247K0FKEDHP; Manufacturer: Vishay Dale
R83 = ESR01MZPF1004: ANTI-SURGE CHIP RESISTORS; Part Number: ESR01MZPF1004; Value: 1 MOhms
TP8 TP22-TP24 TP28 TP30-TP33 TP35 TP36 = TP_1

## Sheet 08_RADAR_INTERFACE.SchDoc: =TitleParameter
size A3; Address: Crete IL; Organization: ASISGUARD; Address1: Kemalpasa, Kemalpasa Cd. No:290 D:292H, 35060 Bornova/Izmir/Turkey; Revision: R1M1
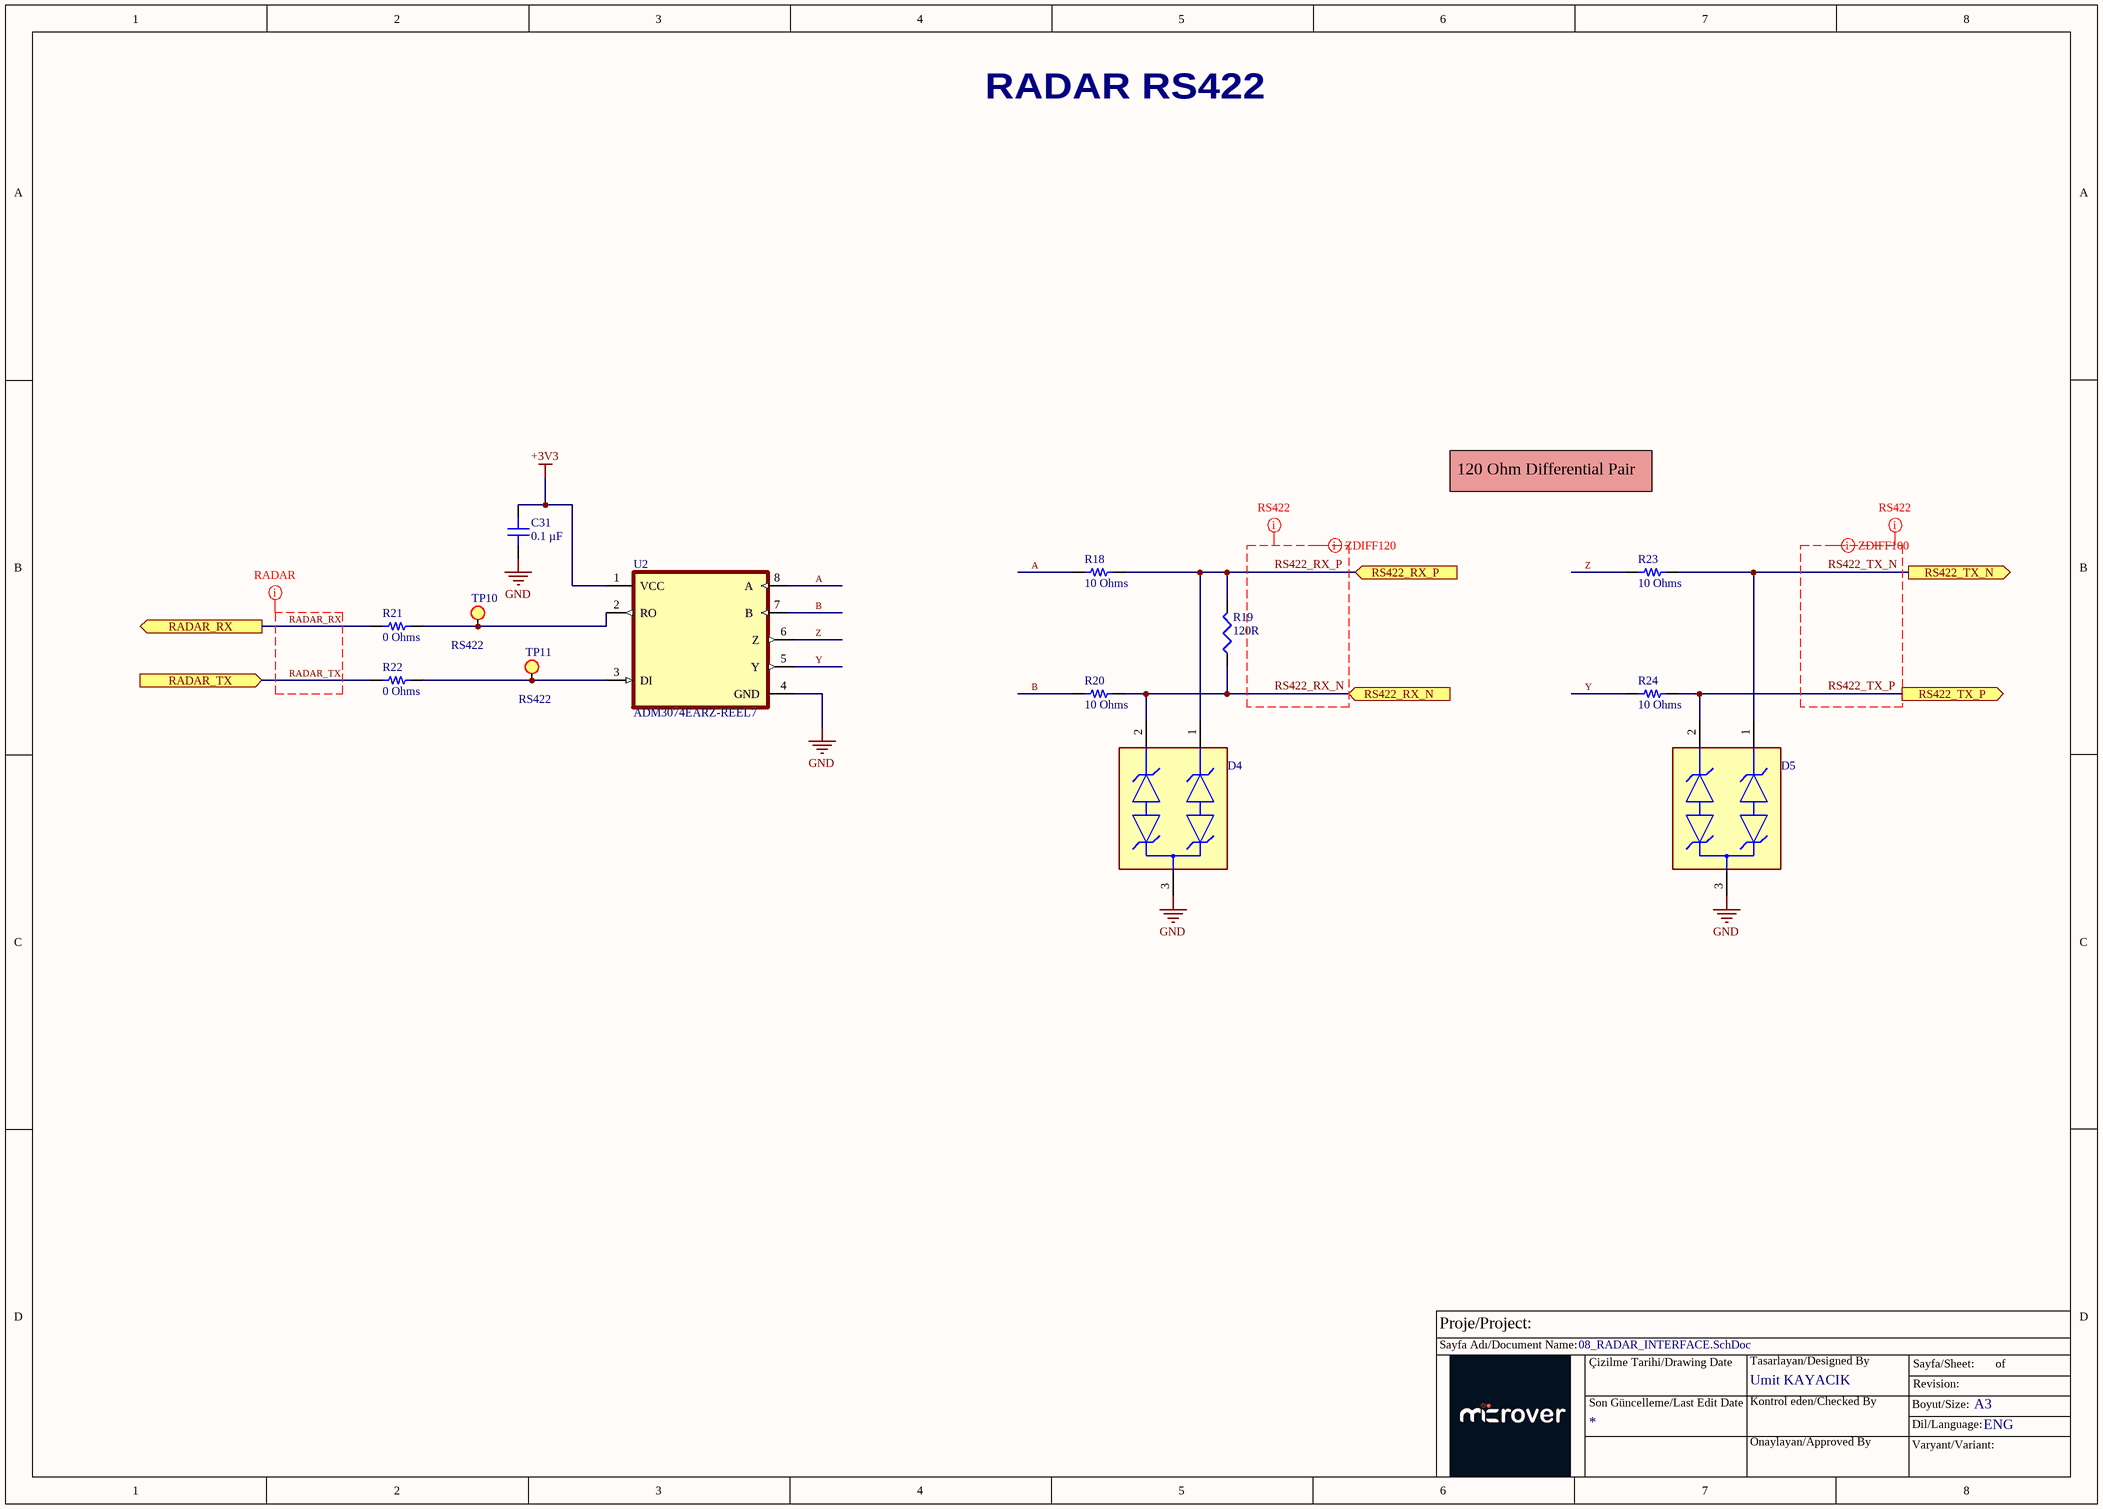
[diagram p7: 08_RADAR_INTERFACE.SchDoc]

### Parts
C31  0.1 µF  [CAP 0603_1608]
D4  SM712-02HTG  [Littelfuse_SM712_MFG]  (value not drawn)
D5  SM712-02HTG  [Littelfuse_SM712_MFG]  (value not drawn)
R18  10 Ohms  [RES 0603_1608]
R19  value 120R  [RES1206]  (hidden comment: RES SMD 120 OHM 1% 1/2W 1206)
R20  10 Ohms  [RES 0603_1608]
R21  0 Ohms  [RES 0402_1005]
R22  0 Ohms  [RES 0402_1005]
R23  10 Ohms  [RES 0603_1608]
R24  10 Ohms  [RES 0603_1608]
TP10  RS422  [TEST_POINT]
TP11  RS422  [TEST_POINT]
U2  ADM3074EARZ-REEL7  [SOIC127P600X175-8N]

### Ports
RADAR_RX (out), RADAR_TX (in), RS422_RX_N (in), RS422_RX_P (in), RS422_TX_N (out), RS422_TX_P (out)

### Nets
+3V3: C31.2 U2.1(VCC)
GND: C31.1 D4.3 D5.3 U2.4(GND)
A: R18.1 U2.8(A)
B: R20.1 U2.7(B)
RADAR_RX: R21.2 ; port RADAR_RX
RADAR_TX: R22.2 ; port RADAR_TX
RS422_RX_N: D4.2 R19.1 R20.2 ; port RS422_RX_N
RS422_RX_P: D4.1 R18.2 R19.2 ; port RS422_RX_P
RS422_TX_N: D5.1 R23.2 ; port RS422_TX_N
RS422_TX_P: D5.2 R24.2 ; port RS422_TX_P
Y: R24.1 U2.5(Y)
Z: R23.1 U2.6(Z)
NetR21_1: R21.1 TP10.1(TP) U2.2(RO)
NetR22_1: R22.1 TP11.1(TP) U2.3(DI)

### Layout directives
net class RS422: RS422_RX_N, RS422_RX_P, RS422_TX_N, RS422_TX_P
net class RADAR: RADAR_RX, RADAR_TX
differential pair; differential pair class ZDIFF120: RS422_RX_N, RS422_RX_P, RS422_TX_N, RS422_TX_P

### Notes on the sheet
- RADAR RS422
- 120 Ohm Differential Pair
- Proje/Project:
- Sayfa Adı/Document Name:
- Çizilme Tarihi/Drawing Date
- Umit KAYACIK
- Tasarlayan/Designed By
- Sayfa/Sheet:
- Revision:
- of
- Son Güncelleme/Last Edit Date
- Kontrol eden/Checked By
- Onaylayan/Approved By
- Boyut/Size:
- Varyant/Variant:
- Dil/Language:
- A3
- ENG

### Library data of the parts
C31 = VJ0603Y104KXAPW1BC: as C80 on sheet 06_BUTTONS; Part Number: VJ0603Y104KXAPW1BC; Value: 0.1 µF; Applications: General Purpose; Capacitance: 0.1 µF; componentlink2description: DigiKey Link; componentlink2url: https://www.digikey.com/en/products/detail/vishay-vitramon/VJ0603Y104KXAPW1BC/10670836; Device Package: 0603 (1608 Metric); lastupdated: 2/9/2024 8:09:50 PM; Lifecycle Status: Active; Minimum Order: 1; Mounting Type: Surface Mount, MLCC; Operating Temperature: -55°C ~ 125°C; Package / Case: 0603 (1608 Metric); packaging: TapeAndReel; partid: 45127; Part Status: Active; price: 0.02; series: VJ W1BC; Size / Dimension: 0.063" L x 0.031" W (1.60mm x 0.80mm); Supplier 1: DigiKey; Supplier Part Number 1: 720-VJ0603Y104KXAPW1BCCT-ND; Temperature Coefficient: X7R; Thickness (Max): 0.037" (0.95mm); Voltage - Rated: 50V
R18 R20 R23 R24 = ERJ-PA3F10R0V: RES SMD 10 OHM 1% 1/3W 0603; Manufacturer: Panasonic Electronic Components; Power (Watts): 0.333W, 1/3W; Temperature Coefficient: ±100ppm/°C; Part Number: ERJ-PA3F10R0V; Value: 10 Ohms; ComponentLink1Description: Datasheet; ComponentLink1URL: https://industrial.panasonic.com/cdbs/www-data/pdf/RDO0000/AOA0000C331.pdf; ComponentLink2Description: DigiKey Link; ComponentLink2URL: https://www.digikey.com/en/products/detail/panasonic-electronic-components/ERJ-PA3F10R0V/5035852; Composition: Thick Film; Device Package: 0603 (1608 Metric); Features: Automotive AEC-Q200, Pulse Withstanding; Height - Seated (Max): 0.022" (0.55mm); LastUpdated: 2/9/2024 8:43:35 PM; Lifecycle Status: Active; Minimum Order: 1; Number of Terminations: 2; Operating Temperature: -55°C ~ 155°C; Package / Case: 0603 (1608 Metric); Packaging: TapeAndReel; PartId: 5368; Part Status: Active; Price: 0.01; Ratings: AEC-Q200; Resistance: 10 Ohms; Series: ERJ-PA3; Size / Dimension: 0.063" L x 0.031" W (1.60mm x 0.80mm); Supplier 1: DigiKey; Supplier Part Number 1: P10.00BYCT-ND; Supplier Device Package: 0603; Tolerance: ±1%
R19 = RES1206_120R_%1: 120 Ohms ±1% 0.5W, 1/2W Chip Resistor 1206 (3216 Metric) Thick Film; Manufacturer Part Number: CRGH1206F120R; Order Code: Digi: A129547TR-ND; Sirius Stock Code: *
R21 R22 = HCJ0402ZT0R00: as R16 on sheet 07_GSM_EM05; Part Number: HCJ0402ZT0R00; Value: 0 Ohms; ComponentLink1Description: Datasheet; ComponentLink1URL: https://www.seielect.com/catalog/sei-hcj.pdf; ComponentLink2Description: DigiKey Link; ComponentLink2URL: https://www.digikey.com/en/products/detail/stackpole-electronics-inc/HCJ0402ZT0R00/4357659; Composition: Metal Foil; Device Package: 0402 (1005 Metric); Features: Automotive AEC-Q200; Height - Seated (Max): 0.018" (0.45mm); LastUpdated: 2/9/2024 8:29:49 PM; Lifecycle Status: Active; Minimum Order: 1; Number of Terminations: 2; Operating Temperature: -55°C ~ 155°C; Package / Case: 0402 (1005 Metric); Packaging: TapeAndReel; PartId: 12327; Part Status: Active; Price: 0.07; Ratings: AEC-Q200; Resistance: 0 Ohms; Series: HCJ; Size / Dimension: 0.039" L x 0.020" W (1.00mm x 0.50mm); Supplier 1: DigiKey; Supplier Part Number 1: HCJ0402ZT0R00CT-ND; Supplier Device Package: 0402; Tolerance: Jumper
TP10 TP11 = TP_1
U2 = ADM3074EARZ-REEL7: Single Transmitter/Receiver RS-422/RS-485 8-Pin SOIC N T/R; Manufacturer: Analog Devices; Data Rate: 500Kbps; Number of Receivers: 1; Operating Supply Voltage: 3.3V; Min Supply Voltage: 3V; Max Supply Voltage: 3.6V; Operating Supply Current: 1.5mA; Simplex/Duplex: Full Duplex; Receiver Hysteresis: 100mV; Supplier 1: Digikey; Manufacturer Part Number: ADM3074EARZ-REEL7; RoHS: Yes; Category: RS-232 / RS-422 / RS-485 Interface ICs; Stock 1: 725; Pricing 1: 1=5.83, 10=5.24, 25=4.954, 100=4.2935, 250=4.07332, 500=3.65498 (USD); Mount: Surface Mount; Case/Package: SOIC; Number of Pins: 8; Min Operating Temperature: -40°C; Max Operating Temperature: 125°C; Packaging: Tape and Reel; Package Quantity: 1000; Number of Transmitters: 1; Logic Function: Receiver; Number of Drivers: 1; Number of Transceivers: 1; Series: -; Supply Current: 1.5mA; Lead Free: Contains Lead; RoHS Compliant: Yes; ComponentLink1URL: http://www.mouser.com/ds/2/609/ADM3070E_3071E_3072E_3073E_3074E_3075E_3076E_3077E-878687.pdf?src-supplier=Mouser; ComponentLink1Description: http://www.mouser.com/ds/2/609/ADM3070E_3071E_3072E_3073E_3074E_3075E_3076E_3077E-878687.pdf?src-supplier=Mouser; ComponentLink2URL: http://components.arrow.com/part/dataview/43007547S8418233N2771?src-supplier=Arrow+Electronics; ComponentLink2Description: http://components.arrow.com/part/dataview/43007547S8418233N2771?src-supplier=Arrow+Electronics; ComponentLink3URL: http://www.analog.com/static/imported-files/data_sheets/ADM3070E_3071E_3072E_3073E_3074E_3075E_3076E_3077E_3078E.pdf?src-supplier=Avnet; ComponentLink3Description: http://www.analog.com/static/imported-files/data_sheets/ADM3070E_3071E_3072E_3073E_3074E_3075E_3076E_3077E_3078E.pdf?src-supplier=Avnet; ComponentLink4URL: http://www.analog.com/media/en/technical-documentation/data-sheets/ADM3070E_3071E_3072E_3073E_3074E_3075E_3076E_3077E_3078E.pdf?src-supplier=Digikey; ComponentLink4Description: http://www.analog.com/media/en/technical-documentation/data-sheets/ADM3070E_3071E_3072E_3073E_3074E_3075E_3076E_3077E_3078E.pdf?src-supplier=Digikey; Supplier Part Number 1: 505-ADM3074EARZ-REEL7CT-ND
D4 D5 = SM712-02HTG: Manufacturer Part Number: SM712-02HTG

## Sheet 09_RS-232_EXT.SchDoc: =TitleParameter
size A3; Address: Crete IL; Organization: ASISGUARD; Address1: Kemalpasa, Kemalpasa Cd. No:290 D:292H, 35060 Bornova/Izmir/Turkey; Revision: R1M1
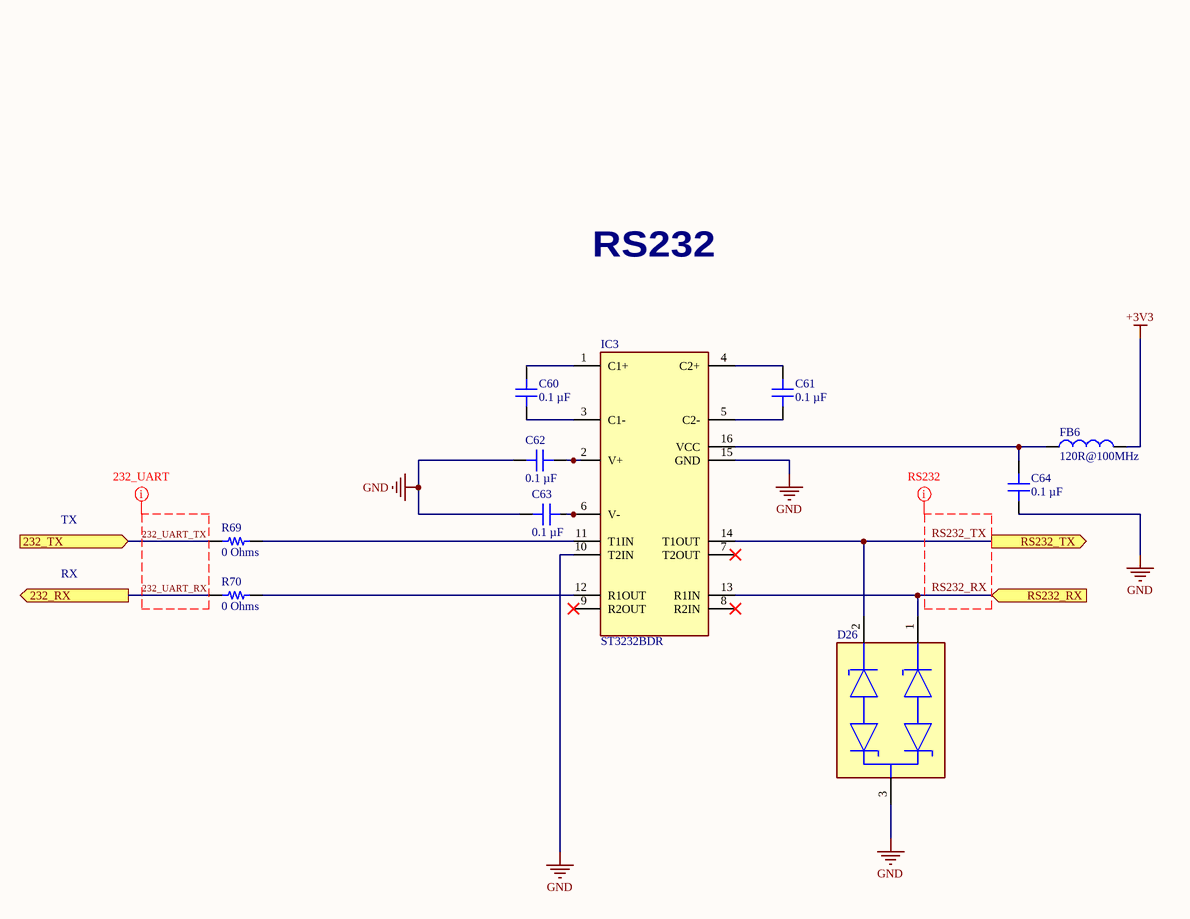
[diagram p8: 09_RS-232_EXT.SchDoc]

### Parts
C60  0.1 µF  [CAP 0805_2012]
C61  0.1 µF  [CAP 0805_2012]
C62  0.1 µF  [CAP 0805_2012]
C63  0.1 µF  [CAP 0805_2012]
C64  0.1 µF  [CAP 0805_2012]
D26  PESD12VL2BT,215  [Nexperia_SOT23_0]  (value not drawn)
FB6  value 120R@100MHz  [FB 0603(1608)]  (hidden comment: FERRITE BEAD 120 OHM 0603 1LN)
IC3  ST3232BDR  [SOIC127P600X175-16N - duplicate]
R69  0 Ohms  [RES 0402_1005]
R70  0 Ohms  [RES 0402_1005]

### Ports
232_RX (out), 232_TX (in), RS232_RX (in), RS232_TX (out)

### Nets
+3V3: FB6.2
GND: C62.2 C63.2 C64.2 D26.3(double_cathode) IC3.10(T2IN) IC3.15(GND)
232_UART_RX: R70.2 ; port 232_RX
232_UART_TX: R69.2 ; port 232_TX
RS232_RX: D26.1(cathode_1) IC3.13(R1IN) ; port RS232_RX
RS232_TX: D26.2(cathode_2) IC3.14(T1OUT) ; port RS232_TX
NetC60_1: C60.1 IC3.3(C1-)
NetC60_2: C60.2 IC3.1(C1+)
NetC61_1: C61.1 IC3.5(C2-)
NetC61_2: C61.2 IC3.4(C2+)
NetC62_1: C62.1 IC3.2(V+)
NetC63_1: C63.1 IC3.6(V-)
NetC64_1: C64.1 FB6.1 IC3.16(VCC)
NetIC3_11: IC3.11(T1IN) R69.1
NetIC3_12: IC3.12(R1OUT) R70.1

Not connected (* = marked no-connect by the designer): IC3 7(T2OUT)* 8(R2IN)* 9(R2OUT)*

### Layout directives
net class RS232: RS232_RX, RS232_TX
net class 232_UART: 232_UART_RX, 232_UART_TX

### Notes on the sheet
- RS232
- TX
- RX
- Proje/Project:
- Sayfa Adı/Document Name:
- Çizilme Tarihi/Drawing Date
- Umit KAYACIK
- Tasarlayan/Designed By
- Sayfa/Sheet:
- Revision:
- of
- Son Güncelleme/Last Edit Date
- Kontrol eden/Checked By
- Onaylayan/Approved By
- Boyut/Size:
- Varyant/Variant:
- Dil/Language:
- A3
- ENG

### Library data of the parts
C60-C64 = C2012X8R1H104K125AA: CAP CER 0.1UF 50V X8R 0805; manufacturer: TDK Corporation; Tolerance: ±10%; Part Number: C2012X8R1H104K125AA; Value: 0.1 µF; Applications: General Purpose; Capacitance: 0.1 µF; componentlink1description: Datasheet; componentlink1url: https://product.tdk.com/info/en/catalog/datasheets/mlcc_commercial_hightemp_en.pdf?ref_disty=digikey; componentlink2description: DigiKey Link; componentlink2url: https://www.digikey.com/en/products/detail/tdk-corporation/C2012X8R1H104K125AA/927140; Device Package: 0805 (2012 Metric); Features: High Temperature; lastupdated: 2/9/2024 8:15:37 PM; Lifecycle Status: Active; Minimum Order: 1; Mounting Type: Surface Mount, MLCC; Operating Temperature: -55°C ~ 150°C; Package / Case: 0805 (2012 Metric); packaging: TapeAndReel; partid: 14313; Part Status: Active; price: 0.02; series: C; Size / Dimension: 0.079" L x 0.049" W (2.00mm x 1.25mm); Supplier 1: DigiKey; Supplier Part Number 1: 445-2514-1-ND; Temperature Coefficient: X8R; Thickness (Max): 0.057" (1.45mm); Voltage - Rated: 50V
D26 = PESD12VL2BT,215: 37V Clamp 5A (8/20µs) Ipp Tvs Diode Surface Mount TO-236AB; Manufacturer: Nexperia USA Inc.; Manufacturer Part Number: PESD12VL2BT,215; Voltage - Clamping (Max) @ Ipp: 37V; Current - Peak Pulse (10/1000µs): 5A
FB6 = FB0603_120R@100MHz: 120 Ohms @ 100 MHz 1 Power Line Ferrite Bead 0603 (1608 Metric) 3A 30mOhm; Manufacturer Part Number: BLM18KG121TH1D; Order Code: Digi:490-13261-2-ND; LCSC Manufacturer Part Number: BLM18KG121TH1D; LCSC Part Number: C437404
IC3 = ST3232BDR: ST3232B Series 5.5 V 400 kbps Low Power RS-232 Drivers and Receiver - SOIC-16; Manufacturer: STMicroelectronics; Supplier 1: Digikey; Manufacturer Part Number: ST3232BDR; RoHS: Yes; Category: Interface ICs; Stock 1: 10000; Pricing 1: 2500=0.84878, 5000=0.81734, 12500=0.78591 (USD); ComponentLink1URL: https://datasheet.ciiva.com/5825/1766333-5825810.pdf?src-supplier=Farnell; ComponentLink1Description: https://datasheet.ciiva.com/5825/1766333-5825810.pdf?src-supplier=Farnell; ComponentLink2URL: https://datasheet.ciiva.com/16391/st3232bdr-16391763.pdf?src-supplier=Future+Electronics; ComponentLink2Description: https://datasheet.ciiva.com/16391/st3232bdr-16391763.pdf?src-supplier=Future+Electronics; ComponentLink3URL: https://datasheet.ciiva.com/1701/cd00002253-1701454.pdf?src-supplier=Digikey; ComponentLink3Description: https://datasheet.ciiva.com/1701/cd00002253-1701454.pdf?src-supplier=Digikey; ComponentLink4URL: https://datasheet.ciiva.com/1701/cd00002253-1701455.pdf?src-supplier=Digikey; ComponentLink4Description: https://datasheet.ciiva.com/1701/cd00002253-1701455.pdf?src-supplier=Digikey; ComponentLink5URL: https://datasheet.ciiva.com/1701/cd00002253-1701456.pdf?src-supplier=Digikey; ComponentLink5Description: https://datasheet.ciiva.com/1701/cd00002253-1701456.pdf?src-supplier=Digikey; Supplier Part Number 1: 497-6533-2-ND
R69 R70 = HCJ0402ZT0R00: as R16 on sheet 07_GSM_EM05; Part Number: HCJ0402ZT0R00; Value: 0 Ohms; ComponentLink1Description: Datasheet; ComponentLink1URL: https://www.seielect.com/catalog/sei-hcj.pdf; ComponentLink2Description: DigiKey Link; ComponentLink2URL: https://www.digikey.com/en/products/detail/stackpole-electronics-inc/HCJ0402ZT0R00/4357659; Composition: Metal Foil; Device Package: 0402 (1005 Metric); Features: Automotive AEC-Q200; Height - Seated (Max): 0.018" (0.45mm); LastUpdated: 2/9/2024 8:29:49 PM; Lifecycle Status: Active; Minimum Order: 1; Number of Terminations: 2; Operating Temperature: -55°C ~ 155°C; Package / Case: 0402 (1005 Metric); Packaging: TapeAndReel; PartId: 12327; Part Status: Active; Price: 0.07; Ratings: AEC-Q200; Resistance: 0 Ohms; Series: HCJ; Size / Dimension: 0.039" L x 0.020" W (1.00mm x 0.50mm); Supplier 1: DigiKey; Supplier Part Number 1: HCJ0402ZT0R00CT-ND; Supplier Device Package: 0402; Tolerance: Jumper